# Altium schematic sheet AD9959.SchDoc: AD9959 4-Channel 500M DDS Module
size A4; Date: 2022.4.26; ApprovedBy: Pablo; CheckedBy: Pablo; Author: Pablo; CompanyName: STI; DrawnBy: Pablo; Engineer: Pablo; Organization: STI; DocumentNumber: 1; Revision: 1; SheetNumber: 1; SheetTotal: 4; Time: 2022.4.26
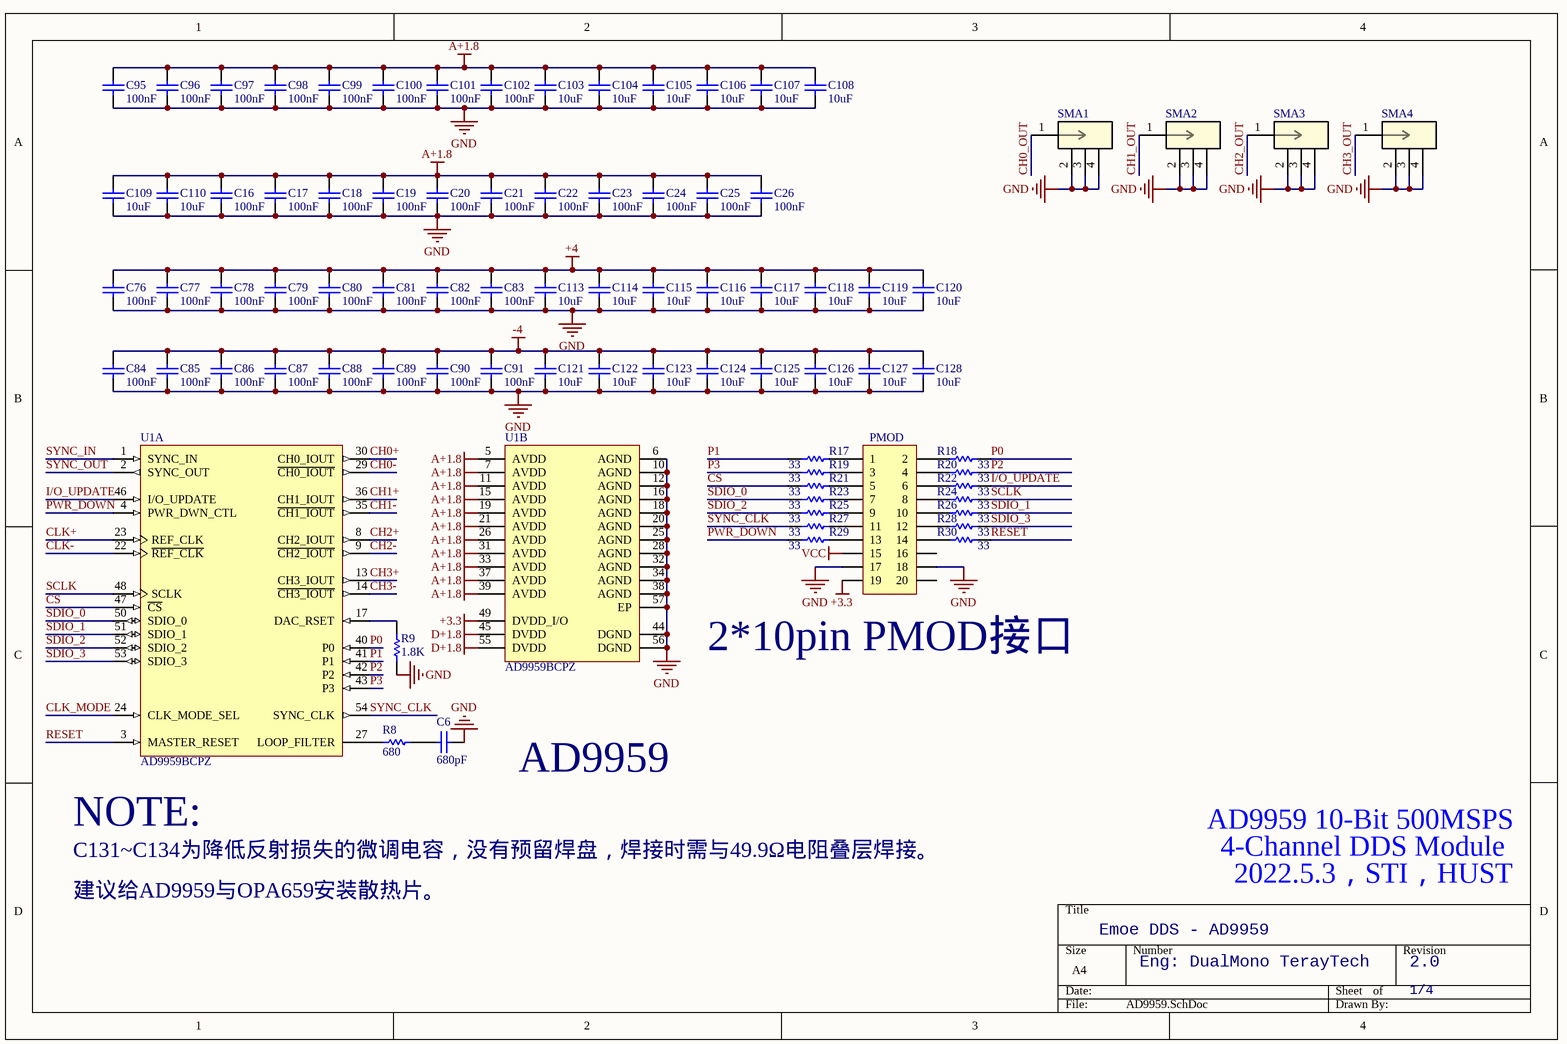
[diagram p0: AD9959.SchDoc]

## Parts
C6  680pF  [0402]
C16  100nF  [0402]
C17  100nF  [0402]
C18  100nF  [0402]
C19  100nF  [0402]
C20  100nF  [0402]
C21  100nF  [0402]
C22  100nF  [0402]
C23  100nF  [0402]
C24  100nF  [0402]
C25  100nF  [0402]
C26  100nF  [0402]
C76  100nF  [0402]
C77  100nF  [0402]
C78  100nF  [0402]
C79  100nF  [0402]
C80  100nF  [0402]
C81  100nF  [0402]
C82  100nF  [0402]
C83  100nF  [0402]
C84  100nF  [0402]
C85  100nF  [0402]
C86  100nF  [0402]
C87  100nF  [0402]
C88  100nF  [0402]
C89  100nF  [0402]
C90  100nF  [0402]
C91  100nF  [0402]
C95  100nF  [0402]
C96  100nF  [0402]
C97  100nF  [0402]
C98  100nF  [0402]
C99  100nF  [0402]
C100  100nF  [0402]
C101  100nF  [0402]
C102  100nF  [0402]
C103  10uF  [0402]
C104  10uF  [0402]
C105  10uF  [0402]
C106  10uF  [0402]
C107  10uF  [0402]
C108  10uF  [0402]
C109  10uF  [0402]
C110  10uF  [0402]
C113  10uF  [0402]
C114  10uF  [0402]
C115  10uF  [0402]
C116  10uF  [0402]
C117  10uF  [0402]
C118  10uF  [0402]
C119  10uF  [0402]
C120  10uF  [0402]
C121  10uF  [0402]
C122  10uF  [0402]
C123  10uF  [0402]
C124  10uF  [0402]
C125  10uF  [0402]
C126  10uF  [0402]
C127  10uF  [0402]
C128  10uF  [0402]
PMOD  Header 2X10  [201R2X10]  (value not drawn)
R8  680  [0402]
R9  1.8K  [0402]
R17  33  [0402]
R18  33  [0402]
R19  33  [0402]
R20  33  [0402]
R21  33  [0402]
R22  33  [0402]
R23  33  [0402]
R24  33  [0402]
R25  33  [0402]
R26  33  [0402]
R27  33  [0402]
R28  33  [0402]
R29  33  [0402]
R30  33  [0402]
SMA1  132414  [CONN_132414_AMP]  (value not drawn)
SMA2  132414  [CONN_132414_AMP]  (value not drawn)
SMA3  132414  [CONN_132414_AMP]  (value not drawn)
SMA4  132414  [CONN_132414_AMP]  (value not drawn)
U1  AD9959BCPZ  [ADI-CP-56-1_L]  (parts A,B of 2)

## Nets
+3.3: PMOD.19 U1.49(DVDD_I/O)
+4: C76.1 C77.1 C78.1 C79.1 C80.1 C81.1 C82.1 C83.1 C113.1 C114.1 C115.1 C116.1 C117.1 C118.1 C119.1 C120.1
-4: C84.1 C85.1 C86.1 C87.1 C88.1 C89.1 C90.1 C91.1 C121.1 C122.1 C123.1 C124.1 C125.1 C126.1 C127.1 C128.1
A+1.8: C16.1 C17.1 C18.1 C19.1 C20.1 C21.1 C22.1 C23.1 C24.1 C25.1 C26.1 C95.1 C96.1 C97.1 C98.1 C99.1 C100.1 C101.1 C102.1 C103.1 C104.1 C105.1 C106.1 C107.1 C108.1 C109.1 C110.1 U1.5(AVDD) U1.7(AVDD) U1.11(AVDD) U1.15(AVDD) U1.19(AVDD) U1.21(AVDD) U1.26(AVDD) U1.31(AVDD) U1.33(AVDD) U1.37(AVDD) U1.39(AVDD)
D+1.8: U1.45(DVDD) U1.55(DVDD)
GND: C6.1 C16.2 C17.2 C18.2 C19.2 C20.2 C21.2 C22.2 C23.2 C24.2 C25.2 C26.2 C76.2 C77.2 C78.2 C79.2 C80.2 C81.2 C82.2 C83.2 C84.2 C85.2 C86.2 C87.2 C88.2 C89.2 C90.2 C91.2 C95.2 C96.2 C97.2 C98.2 C99.2 C100.2 C101.2 C102.2 C103.2 C104.2 C105.2 C106.2 C107.2 C108.2 C109.2 C110.2 C113.2 C114.2 C115.2 C116.2 C117.2 C118.2 C119.2 C120.2 C121.2 C122.2 C123.2 C124.2 C125.2 C126.2 C127.2 C128.2 PMOD.17 PMOD.18 R9.2 SMA1.2 SMA1.3 SMA1.4 SMA2.2 SMA2.3 SMA2.4 SMA3.2 SMA3.3 SMA3.4 SMA4.2 SMA4.3 SMA4.4 U1.6(AGND) U1.10(AGND) U1.12(AGND) U1.16(AGND) U1.18(AGND) U1.20(AGND) U1.25(AGND) U1.28(AGND) U1.32(AGND) U1.34(AGND) U1.38(AGND) U1.44(DGND) U1.56(DGND) U1.57(EP)
VCC: PMOD.15
CH0+: U1.30(CH0_IOUT)
CH0-: U1.29(~{CH0_IOUT})
CH0_OUT: SMA1.1
CH1+: U1.36(CH1_IOUT)
CH1-: U1.35(~{CH1_IOUT})
CH1_OUT: SMA2.1
CH2+: U1.8(CH2_IOUT)
CH2-: U1.9(~{CH2_IOUT})
CH2_OUT: SMA3.1
CH3+: U1.13(CH3_IOUT)
CH3-: U1.14(~{CH3_IOUT})
CH3_OUT: SMA4.1
CLK+: U1.23(REF_CLK)
CLK-: U1.22(~{REF_CLK})
CLK_MODE: U1.24(CLK_MODE_SEL)
CS: R21.2 U1.47(~{CS})
I/O_UPDATE: R22.1 U1.46(I/O_UPDATE)
P0: R18.1 U1.40(P0)
P1: R17.2 U1.41(P1)
P2: R20.1 U1.42(P2)
P3: R19.2 U1.43(P3)
PWR_DOWN: R29.2 U1.4(PWR_DWN_CTL)
RESET: R30.1 U1.3(MASTER_RESET)
SCLK: R24.1 U1.48(SCLK)
SDIO_0: R23.2 U1.50(SDIO_0)
SDIO_1: R26.1 U1.51(SDIO_1)
SDIO_2: R25.2 U1.52(SDIO_2)
SDIO_3: R28.1 U1.53(SDIO_3)
SYNC_CLK: R27.2 U1.54(SYNC_CLK)
SYNC_IN: U1.1(SYNC_IN)
SYNC_OUT: U1.2(SYNC_OUT)
NetC6_2: C6.2 R8.2
NetPMOD_1: PMOD.1 R17.1
NetPMOD_2: PMOD.2 R18.2
NetPMOD_3: PMOD.3 R19.1
NetPMOD_4: PMOD.4 R20.2
NetPMOD_5: PMOD.5 R21.1
NetPMOD_6: PMOD.6 R22.2
NetPMOD_7: PMOD.7 R23.1
NetPMOD_8: PMOD.8 R24.2
NetPMOD_9: PMOD.9 R25.1
NetPMOD_10: PMOD.10 R26.2
NetPMOD_11: PMOD.11 R27.1
NetPMOD_12: PMOD.12 R28.2
NetPMOD_13: PMOD.13 R29.1
NetPMOD_14: PMOD.14 R30.2
NetR8_1: R8.1 U1.27(LOOP_FILTER)
NetR9_1: R9.1 U1.17(DAC_RSET)

Not connected (* = marked no-connect by the designer): PMOD 16 20

## Notes on the sheet
- (near PMOD) 2*10pin PMOD接口
- AD9959
- (near U1) NOTE:
- C131~C134为降低反射损失的微调电容，没有预留焊盘，焊接时需与49.9Ω电阻叠层焊接。
- AD9959 10-Bit 500MSPS
- 4-Channel DDS Module
- 建议给AD9959与OPA659安装散热片。
- Emoe DDS - AD9959
- 2022.5.3，STI，HUST
- Eng: DualMono TerayTech
- 2.0
- 1/4
- Title:
- Size:
- Date:
- A4
- No.:
- Sheet           of
- Revision:
- Author:
- File:

## Library data of the parts
C6 C16-C26 C76-C91 C95-C110 C113-C128 = CAP: Capacitor; Value: 104; Published: 8-Jun-2000; LatestRevisionDate: 17-Jul-2002; LatestRevisionNote: Re-released for DXP Platform.; PackageReference: RAD-0.3; Publisher: Altium Limited
PMOD = Header 10X2: 10*2P接插件; 淘宝ID: 小糖豆的小窝窝; BOM名称: 10*2P接插件; 下单链接: https://item.taobao.com/item.htm?ft=t&id=613637044352
R8 R9 R17-R30 = RES: Resistor; Value: 1K; Published: 8-Jun-2000; Revision: July-2002: Re-released for DXP Platform.; Publisher: Altium Limited
SMA1-SMA4 = 132414: No Description Available; Mfr_Name: Amphenol ICC; Copyright: Copyright (C) 2022 Ultra Librarian. All rights reserved.; Manufacturer_Part_Number: 132414; RefDes: RefDes; Type: DEV
U1 = CMP-0293-00014-1: 4-Channel, 500 MSPS DDS with 10-Bit DACs, Serial, CP-56-1, 260 Tray, Pb-Free; Tuning Word Width (bits): 32bit; Master fclk: 500MHz; Compliance Range (V): 2.3V; FS Iout (mA nom): 10mA; REFCLK Multiplier: Yes; I Supply total (max): 180mA; Resolution (Bits): 10bit; ComponentLink3URL: http://www.analog.com/static/imported-files/packages/32698137492825CP_56_1.pdf; PackageDescription: 56-Lead Lead Frame Chip Scale Package [LFCSP_VQ]; DatasheetVersion: Rev. B; ComponentLink1URL: www.analog.com; PackageVersion: 112805-0; ComponentLink1Description: Manufacturer URL; ComponentLink2Description: Datasheet; Code_JEDEC: MO-220-VLLD-2; ComponentLink2URL: http://www.analog.com/static/imported-files/data_sheets/AD9959.pdf; PackageReference: CP-56-1; I/O Interface: Serial; ComponentLink3Description: Package Specification